# Altium project AUV_PDB_DIP.PrjPcb
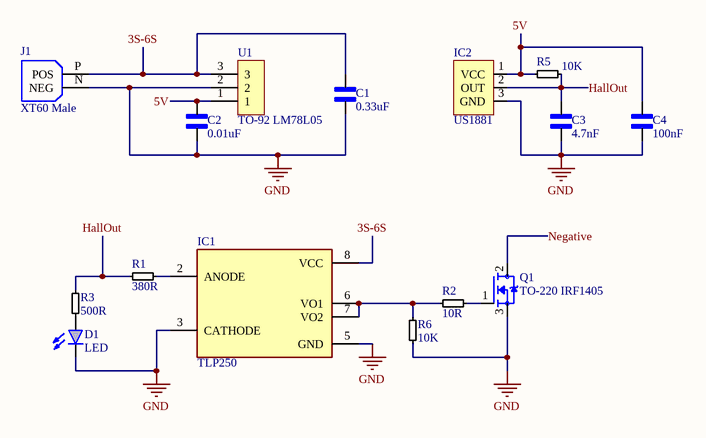
[diagram p0: Sch.SchDoc]
1 sheet, 15 parts. Net scope: global (net labels, ports and power ports of the same name join across sheets).
Board file: PCB.PcbDoc

## Sheet Sch.SchDoc
size A4; SheetNumber: 1; SheetTotal: 1

### Parts
C1  0.33uF  [CER-DIP-CAP]
C2  0.01uF  [CER-DIP-CAP]
C3  4.7nF  [CER-DIP-CAP]
C4  100nF  [CER-DIP-CAP]
D1  LED  [LED DIP]
IC1  TLP250  [DIP-8]
IC2  US1881  [UA]
J1  XT60 Male  [XT60 Male Pin]
Q1  TO-220 IRF1405  [TO-220]
R1  380R  [RES DIP]
R2  10R  [RES DIP]
R3  500R  [RES DIP]
R5  10K  [RES DIP]
R6  10K  [RES DIP]
U1  TO-92 LM78L05  [TO-226 TO-92]

### Nets
GND: C1.1 C2.1 C3.1 C4.1 D1.C IC1.3(CATHODE) IC1.5(GND) IC2.3(GND) J1.N(NEG) Q1.3(S) R6.1 U1.2
3S-6S: C1.2 IC1.8(VCC) J1.P(POS) U1.3
5V: C2.2 C4.2 IC2.1(VCC) R5.1 U1.1
HallOut: C3.2 IC2.2(OUT) R1.1 R3.1 R5.2
Negative: Q1.2(D)
NetD1_A: D1.A R3.2
NetIC1_2: IC1.2(ANODE) R1.2
NetIC1_6: IC1.6(VO1) IC1.7(VO2) R2.1 R6.2
NetQ1_1: Q1.1(G) R2.2

### Library data of the parts
C1-C4 = CAP DIP
D1 = LED DIP
IC1 = TLP250-DIP
J1 = XT60 Male Pin
Q1 = TO-220 MOSFET
R1-R3 R5 R6 = RES DIP
U1 = TO-92